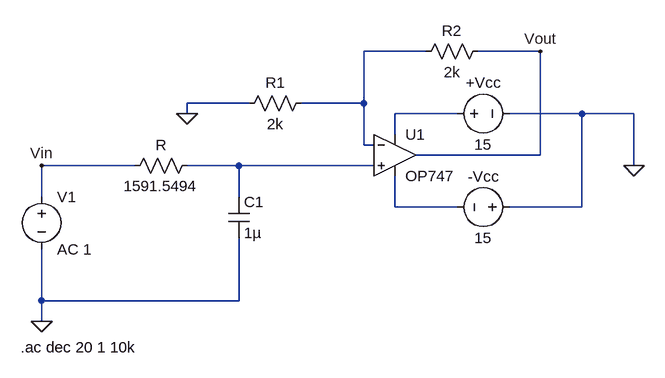
[diagram p0: schematic RC_Active Lowpass Filter.asc]
RC_Active Lowpass Filter.asc, the LTspice schematic file:
Version 4
SHEET 1 880 680
WIRE 432 -64 336 -64
WIRE 608 -64 512 -64
WIRE 160 16 64 16
WIRE 336 16 336 -64
WIRE 336 16 240 16
WIRE 64 32 64 16
WIRE 480 32 384 32
WIRE 672 32 560 32
WIRE 752 32 672 32
WIRE 384 64 384 32
WIRE 336 80 336 16
WIRE 352 80 336 80
WIRE 608 96 608 -64
WIRE 608 96 416 96
WIRE -16 112 -160 112
WIRE 144 112 64 112
WIRE 352 112 144 112
WIRE 752 112 752 32
WIRE -160 160 -160 112
WIRE 144 160 144 112
WIRE 384 176 384 128
WIRE 480 176 384 176
WIRE 672 176 672 32
WIRE 672 176 560 176
WIRE -160 320 -160 240
WIRE 144 320 144 224
WIRE 144 320 -160 320
WIRE -160 352 -160 320
FLAG 64 32 0
FLAG -160 352 0
FLAG 752 112 0
FLAG -160 112 Vin
FLAG 608 -64 Vout
SYMBOL cap 128 160 R0
SYMATTR InstName C1
SYMATTR Value 1µ
SYMBOL res 80 96 R90
WINDOW 0 0 56 VBottom 2
WINDOW 3 32 56 VTop 2
SYMATTR InstName R
SYMATTR Value 1591.5494
SYMBOL voltage -160 144 R0
WINDOW 123 24 97 Left 2
WINDOW 39 0 0 Left 0
SYMATTR Value2 AC 1
SYMATTR InstName V1
SYMATTR Value ""
SYMBOL OpAmps\\OP747 384 32 R0
SYMATTR InstName U1
SYMBOL res 256 0 R90
WINDOW 0 0 56 VBottom 2
WINDOW 3 32 56 VTop 2
SYMATTR InstName R1
SYMATTR Value 2k
SYMBOL res 528 -80 R90
WINDOW 0 0 56 VBottom 2
WINDOW 3 32 56 VTop 2
SYMATTR InstName R2
SYMATTR Value 2k
SYMBOL voltage 464 32 R270
WINDOW 0 32 56 VTop 2
WINDOW 3 -32 56 VBottom 2
WINDOW 123 0 0 Left 0
WINDOW 39 0 0 Left 0
SYMATTR InstName +Vcc
SYMATTR Value 15
SYMBOL voltage 576 176 R90
WINDOW 0 -32 56 VBottom 2
WINDOW 3 32 56 VTop 2
WINDOW 123 0 0 Left 0
WINDOW 39 0 0 Left 0
SYMATTR InstName -Vcc
SYMATTR Value 15
TEXT -192 392 Left 2 !.ac dec 20 1 10k

The netlist it stands for:
* RC_Active Lowpass Filter.asc
C1 N003 0 1µ
R N003 Vin 1591.5494
V1 Vin 0 AC 1
XU1 N003 N001 N002 N004 Vout OP747  ; pins In+ In- V+ V- OUT
R1 N001 0 2k
R2 Vout N001 2k
V§+Vcc N002 0 15
V§-Vcc 0 N004 15
.ac dec 20 1 10k
.backanno
.end